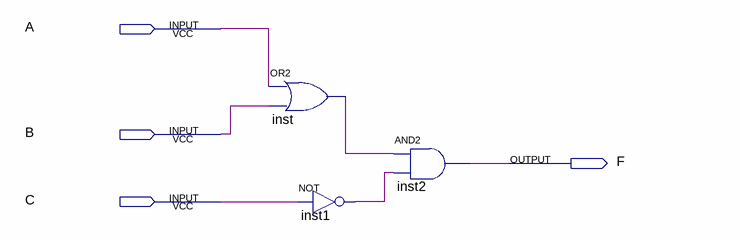
[diagram p0: schematic sheet]
// Quartus schematic lab2step1.bdf as structural Verilog: 3 symbols, 4 pins
module lab2step1 (
  input  A,
  input  B,
  input  C,
  output F
);

  wire inst1_out, inst_out;

  or inst (inst_out, A, B);
  not inst1 (inst1_out, C);
  and inst2 (F, inst_out, inst1_out);
endmodule
